# Altium schematic sheet Medusa-AI-coral-dev.SchDoc
size Legal; SheetNumber: 5; SheetTotal: 5
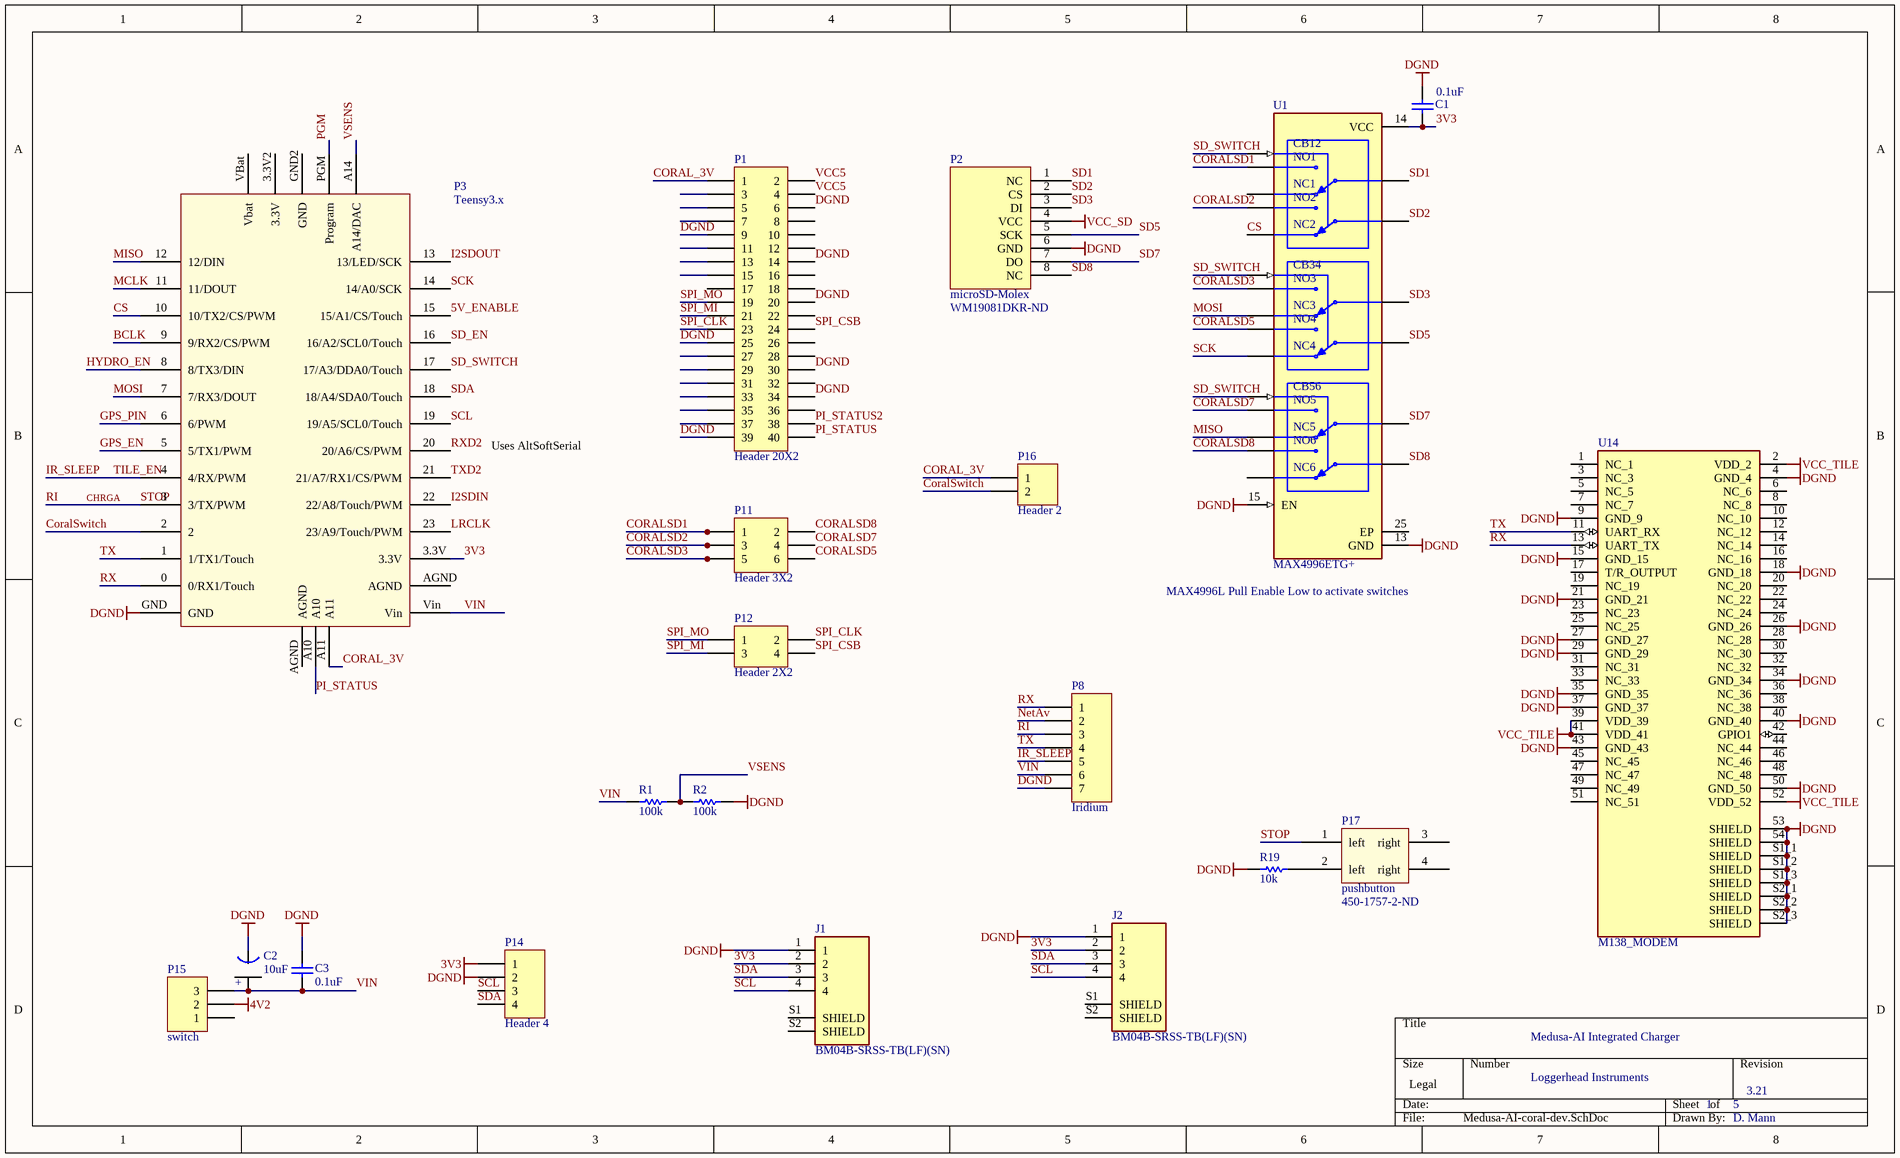
[diagram p0: Medusa-AI-coral-dev.SchDoc]

## Parts
C1  0.1uF  [0402]
C2  10uF  [Tant0805]
C3  0.1uF  [0402]
J1  BM04B-SRSS-TB(LF)(SN)  [CONN_BM04B-SRSS-TB(LF)(SN)]
J2  BM04B-SRSS-TB(LF)(SN)  [CONN_BM04B-SRSS-TB(LF)(SN)]
P1  Header 20X2  [HDR2X20]
P2  microSD-Molex  Supplier Part Number 1: WM19081DKR-ND  [microSD_Molex_hinged]
P3  Teensy3.x  [Teensy3.x]
P8  Iridium  [HDR1X7]
P11  Header 3X2  [HDR2X3]
P12  Header 2X2  [HDR2X2]
P14  Header 4  [HDR1X4]
P15  switch  [HDR1X3]
P16  Header 2  [HDR1X2]
P17  pushbutton  Supplier Part Number 1: 450-1757-2-ND  [SOP4]
R1  100k  [3-0603]
R2  100k  [3-0603]
R19  10k  [3-0603]
U1  MAX4996ETG+  [QFN40P350X350X80-25N]
U14  M138_MODEM  [XCVR_M138_MODEM]

## Nets
3V3: C1.1 J1.2 J2.2 P3.3.3V P14.1 U1.14(VCC)
4V2: P15.2
DGND: C1.2 C2.1(GND) C3.2 J1.1 J2.1 P1.6 P1.9 P1.14 P1.20 P1.25 P1.30 P1.34 P1.39 P2.6(GND) P3.GND P8.7 P14.2 R2.1 R19.2 U1.13(GND) U1.15(EN) U14.4(GND_4) U14.9(GND_9) U14.15(GND_15) U14.18(GND_18) U14.21(GND_21) U14.26(GND_26) U14.27(GND_27) U14.29(GND_29) U14.34(GND_34) U14.35(GND_35) U14.37(GND_37) U14.40(GND_40) U14.43(GND_43) U14.50(GND_50) U14.53(SHIELD) U14.54(SHIELD) U14.S1_1(SHIELD) U14.S1_2(SHIELD) U14.S1_3(SHIELD) U14.S2_1(SHIELD) U14.S2_2(SHIELD) U14.S2_3(SHIELD)
VCC_SD: P2.4(VCC)
VCC_TILE: U14.2(VDD_2) U14.39(VDD_39) U14.41(VDD_41) U14.52(VDD_52)
5V_ENABLE: P3.15(15/A1/CS/Touch)
BCLK: P3.9(9/RX2/CS/PWM)
CHRGA: P3.3(3/TX/PWM) P8.3 P17.1(left)  [also labelled RI, STOP]
CORAL_3V: P1.1 P3.A11 P16.1
CORALSD1: P11.1 U1.19(NO1)
CORALSD2: P11.3 U1.20(NO2)
CORALSD3: P11.5 U1.21(NO3)
CORALSD5: P11.6 U1.22(NO4)
CORALSD7: P11.4 U1.23(NO5)
CORALSD8: P11.2 U1.24(NO6)
CoralSwitch: P3.2 P16.2
CS: P3.10(10/TX2/CS/PWM) U1.11(NC2)
GPS_EN: P3.5(5/TX1/PWM)
GPS_PIN: P3.6(6/PWM)
HYDRO_EN: P3.8(8/TX3/DIN)
I2SDIN: P3.22(22/A8/Touch/PWM)
I2SDOUT: P3.13(13/LED/SCK)
IR_SLEEP: P3.4(4/RX/PWM) P8.5  [also labelled TILE_EN]
LRCLK: P3.23(23/A9/Touch/PWM)
MCLK: P3.11(11/DOUT)
MISO: P3.12(12/DIN) U1.8(NC5)
MOSI: P3.7(7/RX3/DOUT) U1.10(NC3)
NetAv: P8.2
PGM: P3.PGM(Program)
PI_STATUS: P1.40 P3.A10
PI_STATUS2: P1.38
RX: P3.0(0/RX1/Touch) P8.1 U14.13(UART_TX)
RXD2: P3.20(20/A6/CS/PWM)
SCK: P3.14(14/A0/SCK) U1.9(NC4)
SCL: J1.4 J2.4 P3.19(19/A5/SCL0/Touch) P14.3
SD1: P2.1(NC) U1.18(COM1)
SD2: P2.2(CS) U1.17(COM2)
SD3: P2.3(DI) U1.16(COM3)
SD5: P2.5(SCK) U1.4(COM4)
SD7: P2.7(DO) U1.5(COM5)
SD8: P2.8(NC) U1.6(COM6)
SD_EN: P3.16(16/A2/SCL0/Touch)
SD_SWITCH: P3.17(17/A3/DDA0/Touch) U1.1(CB12) U1.2(CB34) U1.3(CB56)
SDA: J1.3 J2.3 P3.18(18/A4/SDA0/Touch) P14.4
SPI_CLK: P1.23 P12.2
SPI_CSB: P1.24 P12.4
SPI_MI: P1.21 P12.3
SPI_MO: P1.19 P12.1
TX: P3.1(1/TX1/Touch) P8.4 U14.11(UART_RX)
TXD2: P3.21(21/A7/RX1/CS/PWM)
VCC5: P1.2 P1.4
VIN: C2.2(+) C3.1 P3.Vin P8.6 P15.3 R1.2
VSENS: P3.A14(A14/DAC) R1.1 R2.2
NetP17_2: P17.2(left) R19.1

Not connected (* = marked no-connect by the designer): J1 S1(SHIELD) S2(SHIELD); J2 S1(SHIELD) S2(SHIELD); P1 3 5 7 8 10 11 12 13 15 16 17 18 22 26 27 28 29 31 32 33 35 36 37; P3 3.3V2(3.3V) AGND GND2(GND) VBat(Vbat); P15 1; P17 3(right) 4(right); U1 7(NC6) 12(NC1) 25(EP); U14 1(NC_1) 3(NC_3) 5(NC_5) 6(NC_6) 7(NC_7) 8(NC_8) 10(NC_10) 12(NC_12) 14(NC_14) 16(NC_16) 17(T/R_OUTPUT) 19(NC_19) 20(NC_20) 22(NC_22) 23(NC_23) 24(NC_24) 25(NC_25) 28(NC_28) 30(NC_30) 31(NC_31) 32(NC_32) 33(NC_33) 36(NC_36) 38(NC_38) 42(GPIO1) 44(NC_44) 45(NC_45) 46(NC_46) 47(NC_47) 48(NC_48) 49(NC_49) 51(NC_51)

## Notes on the sheet
- Uses AltSoftSerial
- (near U1) MAX4996L Pull Enable Low to activate switches
- Medusa-AI Integrated Charger
- Loggerhead Instruments
- 1
- 5
- 3.21
- D. Mann

## Library data of the parts
C1 C3 = C0402: Ceramic Chip Capacitor - Standard; Note: Footprint corresponds to dimensions for bulk cassette packaging. This case size has tightened tolerances.; Published: 17-Jul-2002; LatestRevisionDate: 19-Mar-2004; LatestRevisionNote: Silkscreen size reduced.; DatasheetDocument: Mar-2001; PackageDocument: Mar-2001; PackageReference: 0402; Publisher: Altium Limited; Code_JEITA: 0402; Code_IPC: 1005 [0402]; ComponentLink1Description: Manufacturer Link; ComponentLink1URL: http://www.kemet.com/; ComponentLink2Description: Datasheet; ComponentLink2URL: http://www.kemet.com/kemet/web/homepage/kechome.nsf/vapubfilesname/F3102TA.pdf/$file/F3102TA.pdf; Value: 0.1uF
C2 = Tant0805: Value: 10uF
J1 J2 = BM04B-SRSS-TB(LF)(SN): Connector Header Surface Mount 4 position 0.039 _1.00mm_; MF: JST Sales; MP: BM04B-SRSS-TB_LF__SN_; Price: None; Availability: Unavailable; Package: None; SnapEDA_Link: https://www.snapeda.com/parts/BM04B-SRSS-TB%28LF%29%28SN%29/JST%20Sales%20America%20Inc./view-part/91778/?ref=snap; Value: *
P1 = Header 20X2: Header, 20-Pin, Dual row; LatestRevisionDate: 17-Jul-2002; LatestRevisionNote: Re-released for DXP Platform.; Publisher: Altium Limited
P2 = microSD_Molex_hinged: Supplier 1: Digi-Key
P8 = Header 7: Header, 7-Pin; LatestRevisionDate: 17-Jul-2002; LatestRevisionNote: Re-released for DXP Platform.; Publisher: Altium Limited
P11 = Header 3X2: Header, 3-Pin, Dual row; LatestRevisionDate: 17-Jul-2002; LatestRevisionNote: Re-released for DXP Platform.; Publisher: Altium Limited
P12 = Header 2X2: Header, 2-Pin, Dual row; LatestRevisionDate: 17-Jul-2002; LatestRevisionNote: Re-released for DXP Platform.; Publisher: Altium Limited
P14 = Header 4: Header, 4-Pin; LatestRevisionDate: 17-Jul-2002; LatestRevisionNote: Re-released for DXP Platform.; Publisher: Altium Limited
P15 = Header 3: Header, 3-Pin; LatestRevisionDate: 17-Jul-2002; LatestRevisionNote: Re-released for DXP Platform.; Publisher: Altium Limited
P16 = Header 2: Header, 2-Pin; LatestRevisionDate: 17-Jul-2002; LatestRevisionNote: Re-released for DXP Platform.; Publisher: Altium Limited
R1 R2 R19 = ERJ3RK: Precision Thick Film Chip Resistor, 10 Ohm to 1M Ohm Range, 1% and 0.5% Tolerance, 0603 Size, 0.063 W; Published: 17-Dec-2003; LatestRevisionDate: 19-Mar-2004; LatestRevisionNote: Silkscreen size reduced.; PackageDocument: Mar-2003; PackageReference: 3-0603; Publisher: Altium Limited; Code_IPC: 1608 [0603]; ComponentLink1Description: Manufacturer Link; ComponentLink1URL: http://www.panasonic.com/industrial/components/resistive_products.htm; ComponentLink2Description: Datasheet; ComponentLink2URL: http://www.panasonic.com/industrial/components/pdf/AOA0000CE2.pdf
U1 = MAX4996ETG+: 3 Circuit IC Switch 2:2 4Ohm 24-TQFN (4x4); MF: Maxim Integrated; SnapEDA_Link: https://www.snapeda.com/parts/MAX4996ETG+/Maxim%20Integrated/view-part/1193961/?ref=snap; Value: *; Purchase-URL: https://pricing.snapeda.com/search/part/MAX4996ETG+/?ref=eda; Price: None; Availability: Warning; Check_prices: https://www.snapeda.com/parts/MAX4996ETG+/Maxim%20Integrated/view-part/1193961/?ref=eda; MP: MAX4996ETG+; Package: TQFN-24 Maxim
U14 = M138_MODEM: Swarm M138 Modem; MF: Swarm; Check_prices: https://www.snapeda.com/parts/M138%20Modem/Swarm/view-part/?ref=eda; Value: *; Package: Package; Price: None; Availability: Not in stock; MP: M138 Modem; SnapEDA_Link: https://www.snapeda.com/parts/M138%20Modem/Swarm/view-part/?ref=snap
P17 = pushbutton: Supplier 1: Digi-Key